# Altium schematic sheet EIS_Main_Power.SchDoc: EIS: Netzteile
size A4; FaxNumber: 07721 / 943 -210; Organization: Hahn-Schickard; Address1: Wilhelm-Schickard-Str. 10; Address2: 78052 Villingen-Schwenningen; Address3: Bernd.Ehrbrecht@Hahn-Schickard.de; DocumentNumber: 1; Revision: 1.0; SheetNumber: 3; SheetTotal: 7; PhoneNumber: 0 7721 943 137; E-Mail: Xxxx.Xxxx@Hahn-Schickard.de; ProjectName: Project File Name
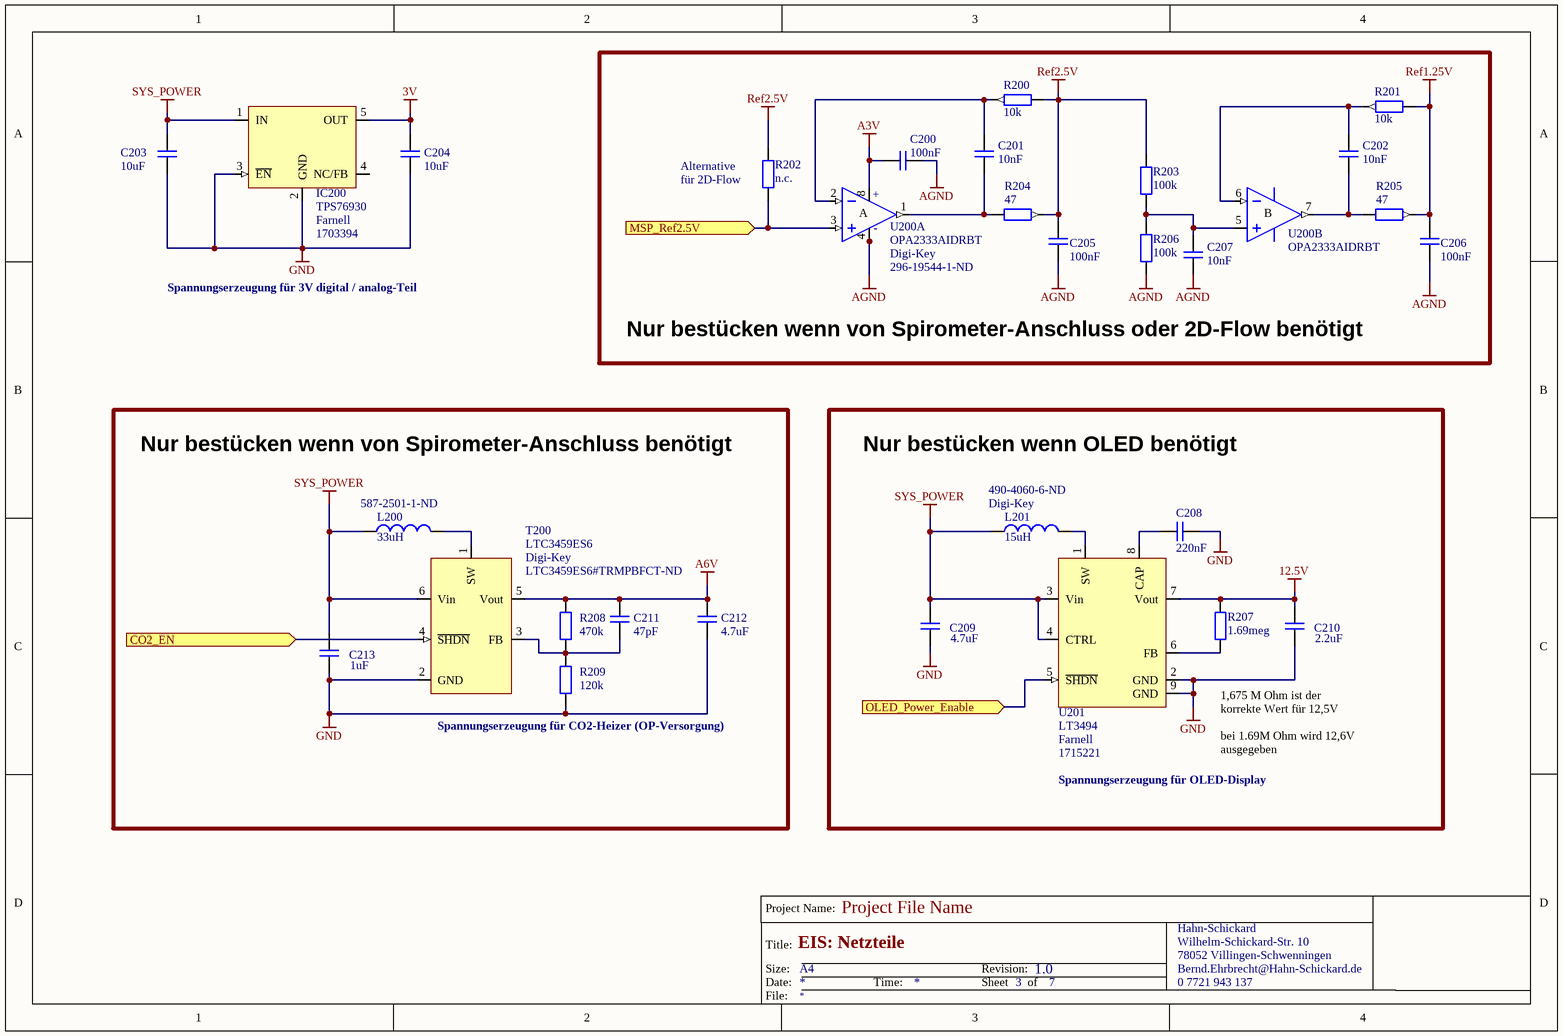
[diagram p0: EIS_Main_Power.SchDoc]

## Parts
C200  100nF  [CAPC1608N]
C201  10nF  [CAPC1608N]
C202  10nF  [CAPC1608N]
C203  10uF  [CAPC1608N]
C204  10uF  [CAPC1608N]
C205  100nF  [CAPC1608N]
C206  100nF  [CAPC1608N]
C207  10nF  [CAPC1608N]
C208  220nF  [CAPC1608N]
C209  4.7uF  [CAPC1608N]
C210  2.2uF  [CAPC1608N]
C211  47pF  [CAPC1608N]
C212  4.7uF  [CAPC1608N]
C213  1uF  [CAPC1608N]
IC200  TPS76930  Supplier 1: Farnell  Supplier Part Number 1: 1703394  [TI-DBV5 (SOT23-5)]
L200  value 33uH  Supplier Part Number 1: 587-2501-1-ND  [RESC2012N]  (hidden comment: Inductor)
L201  Supplier 1: Digi-Key  Supplier Part Number 1: 490-4060-6-ND  [INDC3225N]  (hidden comment: 15uH)
R200  10k  [RESC1608N]
R201  10k  [RESC1608N]
R202  n.c.  [RESC1608N]
R203  100k  [RESC1608N]
R204  47  [RESC1608N]
R205  47  [RESC1608N]
R206  100k  [RESC1608N]
R207  1.69meg  [RESC1608N]
R208  470k  [RESC1608N]
R209  120k  [RESC1608N]
T200  LTC3459ES6  Supplier 1: Digi-Key  Supplier Part Number 1: LTC3459ES6#TRMPBFCT-ND  [TSOT23 - 6]
U200  OPA2333AIDRBT  Supplier 1: Digi-Key  Supplier Part Number 1: 296-19544-1-ND  [TI DRB (S-PVON-N8)]  (parts A,B of 2)
U201  LT3494  Supplier 1: Farnell  Supplier Part Number 1: 1715221  [DFN-DDB-8]

## Blocks framed on the sheet
Spannungserzeugung für CO2-Heizer (OP-Versorgung): C211-C213 L200 R208 R209 T200
Spannungserzeugung für OLED-Display: C208-C210 L201 R207 U201

## Ports
CO2_EN (in), MSP_Ref2.5V (in), OLED_Power_Enable (in)

## Nets
3V: C204.2 IC200.5(OUT)
12.5V: C210.2 R207.2 U201.7(Vout)
A3V: C200.1 U200.8(V+)
A6V: C211.2 C212.2 R208.2 T200.5(Vout)
AGND: C200.2 C205.1 C206.1 C207.1 R206.1 U200.4(V-) U200.9(tp1)
GND: C203.1 C204.1 C208.1 C209.1 C210.1 C212.1 C213.1 IC200.2(GND) IC200.3(~{EN}) R209.1 T200.2(GND) U201.2(GND) U201.9(GND)
Ref1.25V: C206.2 R201.1 R205.2
Ref2.5V: C205.2 R200.1 R202.2 R203.2 R204.2
SYS_POWER: C203.2 C209.2 C213.2 IC200.1(IN) L200.1 L201.1 T200.6(Vin) U201.3(Vin) U201.4(CTRL)
CO2_EN: T200.4(~{SHDN}) ; port CO2_EN
MSP_Ref2.5V: R202.1 U200.3(IN1+) ; port MSP_Ref2.5V
OLED_Power_Enable: U201.5(~{SHDN}) ; port OLED_Power_Enable
NetC201_1: C201.1 R204.1 U200.1(OUT1)
NetC201_2: C201.2 R200.2 U200.2(IN1-)
NetC202_1: C202.1 R205.1 U200.7(OUT1)
NetC202_2: C202.2 R201.2 U200.6(IN1-)
NetC207_2: C207.2 R203.1 R206.2 U200.5(IN1+)
NetC208_2: C208.2 U201.8(CAP)
NetC211_1: C211.1 R208.1 R209.2 T200.3(FB)
NetL200_2: L200.2 T200.1(SW)
NetL201_2: L201.2 U201.1(SW)
NetR207_1: R207.1 U201.6(FB)

Not connected (* = marked no-connect by the designer): IC200 4(NC/FB)

## Notes on the sheet
- (near R202) Alternative
- (near R202) für 2D-Flow
- Spannungserzeugung für 3V digital / analog-Teil
- Nur bestücken wenn von Spirometer-Anschluss oder 2D-Flow benötigt
- Nur bestücken wenn von Spirometer-Anschluss benötigt
- Nur bestücken wenn OLED benötigt
- 1,675 M Ohm ist der korrekte Wert für 12,5V
  bei 1.69M Ohm wird 12,6V ausgegeben
- Project Name:
- Size:
- Date:
- Title:
- A4
- Time:
- Revision:
- Sheet
- of
- File:
- (in symbol OPA2333AIDRBT, part A) +; A; -
- (in symbol OPA2333AIDRBT, part B) B

## Library data of the parts
C200 C205 C206 = Kondensator SMD Keramik: 07_Lieferant: Digi-Key; 08_Lieferanten_Nummer: 399-1096-1-ND
C201 C202 C207 = Kondensator SMD Keramik: 07_Lieferant: Digi-Key; 08_Lieferanten_Nummer: 399-1091-1-ND
C203 C204 = Kondensator SMD Keramik: 07_Lieferant: Digi-Key; 08_Lieferanten_Nummer: 490-7201-1-ND
C208 = Kondensator SMD Keramik: 07_Lieferant: Digi-Key; 08_Lieferanten_Nummer: 445-1318-1-ND
C209 C212 = Kondensator SMD Keramik: 07_Lieferant: Digi-Key; 08_Lieferanten_Nummer: 1276-2087-1-ND
C210 = Kondensator SMD Keramik: 07_Lieferant: Digi-Key; 08_Lieferanten_Nummer: 587-3386-1-ND
C211 = Kondensator SMD Keramik: 07_Lieferant: Digi-Key; 08_Lieferanten_Nummer: 1276-1037-1-ND
C213 = Kondensator SMD Keramik: 07_Lieferant: Digi-Key; 08_Lieferanten_Nummer: 1276-1946-1-ND
IC200 = TPS76930: Low Output, Adjustable, Ultralow-Power, 100-mA Low Dropout Linear Regulator; Package Document: O:\Altium Designer\Datasheets\Texas Instruments\TPS76201; ComponentLink1Description: Texas Instruments; ComponentLink1URL: http://www.ti.com/; ComponentLink2Description: Datasheet; ComponentLink2URL: http://www.ti.com/; DatasheetDokument: O:\Altium Designer\Datasheets\Texas Instruments\TPS76201; Published: 20-09-2011; Publisher: HSG Selvakumar Palanichamy; Supplier: Farnell; Supplier Ordering Number: 1706314; 07_Lieferant: Farnell; 08_Lieferanten_Nummer: 1703394
L200 = Inductor: Code_IEC: 1005; 07_Lieferant: Digi-Key; Published: 8-Jun-2000; LatestRevisionDate: 29-May-2009; LatestRevisionNote: IPC-7351 Footprint Added.; PackageReference: 0402-A; Publisher: Altium Limited; PackageDescription: Chip Inductor; Code_JEITA: 0402; Supplier 1: Digi-Key; 08_Lieferanten_Nummer: 587-2501-1-ND
L201 = Inductor: Code_IEC: 1005; Published: 8-Jun-2000; LatestRevisionDate: 29-May-2009; LatestRevisionNote: IPC-7351 Footprint Added.; PackageReference: 0402-A; Publisher: Altium Limited; PackageDescription: Chip Inductor; Code_JEITA: 0402; Value: 15uH; 07_Lieferant: Digi-Key; 08_Lieferanten_Nummer: 490-4060-6-ND
R200 R201 = Widerstand SMD: Value: 0; 07_Lieferant: Digi-Key; 08_Lieferanten_Nummer: 311-10KGRCT-ND
R202 = Widerstand SMD: Value: n.c.
R203 R206 = Widerstand SMD: 07_Lieferant: Digi-Key; 08_Lieferanten_Nummer: 311-100KGRCT-ND; Value: 100k
R204 R205 = Widerstand SMD: 07_Lieferant: Digi-Key; 08_Lieferanten_Nummer: 311-47GRCT-ND; Value: 47
R207 = Widerstand SMD: 07_Lieferant: Digi-Key; 08_Lieferanten_Nummer: 1276-4940-1-ND
R208 = Widerstand SMD: 07_Lieferant: Digi-Key; 08_Lieferanten_Nummer: 311-470KGRCT-ND
R209 = Widerstand SMD: 07_Lieferant: Digi-Key; 08_Lieferanten_Nummer: 311-120KGRCT-ND; Value: 120k
T200 = Spannung Wandler - LTC3459ES6: 07_Lieferant: Digi-Key; 08_Lieferanten_Nummer: LTC3459ES6#TRMPBFCT-ND
U200 = OPA2333AIDRBT: Dual micro Power OP; 01_Hersteller: Texas Instruments; 05_Datasheet_Link_Lokal: O:\Altium Designer\Datasheets\Texas Instruments\OPA333; 09_Ersteller: HSG Jürgen Merz; 02_Herstellerbezeichnung: ka; 03_Hersteller_Link: http://www.ti.com; 04_Datasheet_Link: Datasheet; 06 Footprint_Link_Lokal: O:\Altium Designer\Datasheets\Texas Instruments\OPA333; 10_Erstell_Datum: 12.10.2010; 07_Lieferant: Digi-Key; 08_Lieferanten_Nummer: 296-19544-1-ND
U201 = LT3494: Bost-Konverter; 07_Lieferant: Farnell; 08_Lieferanten_Nummer: 1715221